# Altium schematic sheet Sheet1.SchDoc
size A4
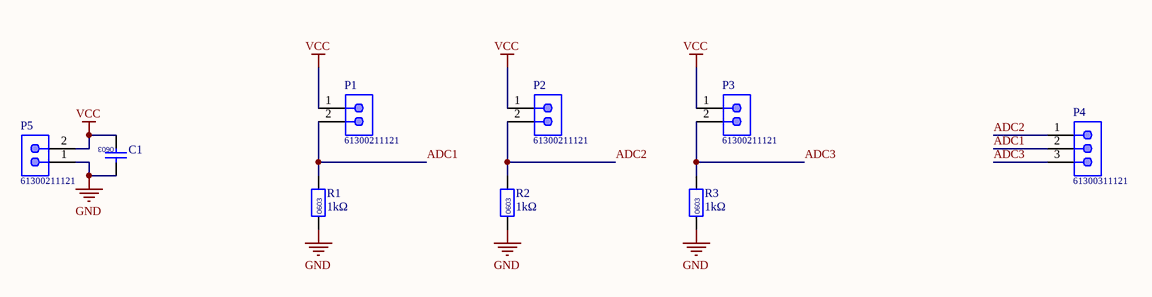
[diagram p0: Sheet1.SchDoc]

## Parts
C1  (no value)  [C_0603]
P1  61300211121  [61300211121]
P2  61300211121  [61300211121]
P3  61300211121  [61300211121]
P4  61300311121  [61300311121]
P5  61300211121  [61300211121]
R1  1kΩ  [R_0603]
R2  1kΩ  [R_0603]
R3  1kΩ  [R_0603]

## Nets
GND: C1.2 P5.1 R1.1 R2.1 R3.1
VCC: C1.1 P1.1 P2.1 P3.1 P5.2
ADC1: P1.2 P4.2 R1.2
ADC2: P2.2 P4.1 R2.2
ADC3: P3.2 P4.3 R3.2

## Notes on the sheet
- (in symbol Resistor_0603) 0603

## Library data of the parts
C1 = Capacitor_0603: MLCC - SMD/SMT Capacitor 50V; Package: 0603; Voltage: 50V; Price: None
P1-P3 P5 = 61300211121: WR-PHD Pin Header, THT, pitch 2.54mm, Single Row, Vertical, 2p; Manufacturer: Wurth Elektronik; Pin Number: 2; Rated Current: 3A; Working Voltage: 250VAC; Withstanding Voltage: 500VAC; Contact Resistance: 20mOhm; ComponentLink1Description: Manufacturer; ComponentLink1URL: http://www.we-online.de; ComponentLink2Description: Datasheet; ComponentLink2URL: https://www.we-online.com/catalog/datasheet/61300211121.pdf; Manufacturer Part Number: 61300211121; Published Date: May 2020; Pitch: 2.54mm; Operating Temperature: -40 to +105degC; Mounting Technology: THT; Packaging: Bag; Gender: Pin Header; Row Number: Single; Orientation: Vertical
P4 = 61300311121: WR-PHD Pin Header, THT, pitch 2.54mm, Single Row, Vertical, 3p; Manufacturer: Wurth Elektronik; Pin Number: 3; Rated Current: 3A; Working Voltage: 250VAC; Withstanding Voltage: 500VAC; Contact Resistance: 20mOhm; ComponentLink1Description: Manufacturer; ComponentLink1URL: http://www.we-online.de; ComponentLink2Description: Datasheet; ComponentLink2URL: https://www.we-online.com/catalog/datasheet/61300311121.pdf; Manufacturer Part Number: 61300311121; Published Date: May 2020; Pitch: 2.54mm; Operating Temperature: -40 to +105degC; Mounting Technology: THT; Packaging: Bag; Gender: Pin Header; Row Number: Single; Orientation: Vertical
R1-R3 = Resistor_0603: SMT Resistor; Value: 1kΩ